# Altium schematic sheet RELAY.SchDoc
size A
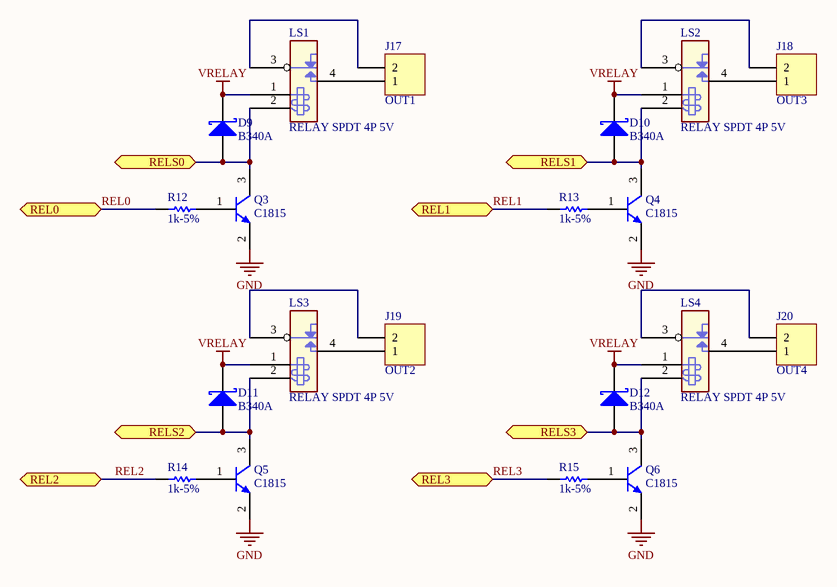
[diagram p0: RELAY.SchDoc]

## Parts
D9  B340A  [DO_213AA]
D10  B340A  [DO_213AA]
D11  B340A  [DO_213AA]
D12  B340A  [DO_213AA]
J17  OUT1  [DOMINO NORMAL 2]
J18  OUT3  [DOMINO NORMAL 2]
J19  OUT2  [DOMINO NORMAL 2]
J20  OUT4  [DOMINO NORMAL 2]
LS1  RELAY SPDT 4P 5V  [RELAY_4PIN_5A_12]
LS2  RELAY SPDT 4P 5V  [RELAY_4PIN_5A_12]
LS3  RELAY SPDT 4P 5V  [RELAY_4PIN_5A_12]
LS4  RELAY SPDT 4P 5V  [RELAY_4PIN_5A_12]
Q3  C1815  [SOT-23B_N]
Q4  C1815  [SOT-23B_N]
Q5  C1815  [SOT-23B_N]
Q6  C1815  [SOT-23B_N]
R12  1k-5%  [R0603]
R13  1k-5%  [R0603]
R14  1k-5%  [R0603]
R15  1k-5%  [R0603]

## Ports
REL0, REL1, REL2, REL3, RELS0, RELS1, RELS2, RELS3

## Nets
GND: Q3.2(E) Q4.2(E) Q5.2(E) Q6.2(E)
VRELAY: D9.2(K) D10.2(K) D11.2(K) D12.2(K) LS1.1(COIL1) LS2.1(COIL1) LS3.1(COIL1) LS4.1(COIL1)
REL0: R12.1 ; port REL0
REL1: R13.1 ; port REL1
REL2: R14.1 ; port REL2
REL3: R15.1 ; port REL3
RELS0: D9.1(A) LS1.2(COIL2) Q3.3(C) ; port RELS0
RELS1: D10.1(A) LS2.2(COIL2) Q4.3(C) ; port RELS1
RELS2: D11.1(A) LS3.2(COIL2) Q5.3(C) ; port RELS2
RELS3: D12.1(A) LS4.2(COIL2) Q6.3(C) ; port RELS3
NetJ17_1: J17.1 LS1.4(NO)
NetJ17_2: J17.2 LS1.3(COMMON)
NetJ18_1: J18.1 LS2.4(NO)
NetJ18_2: J18.2 LS2.3(COMMON)
NetJ19_1: J19.1 LS3.4(NO)
NetJ19_2: J19.2 LS3.3(COMMON)
NetJ20_1: J20.1 LS4.4(NO)
NetJ20_2: J20.2 LS4.3(COMMON)
NetQ3_1: Q3.1(B) R12.2
NetQ4_1: Q4.1(B) R13.2
NetQ5_1: Q5.1(B) R14.2
NetQ6_1: Q6.1(B) R15.2

## Library data of the parts
D9-D12 = D Schottky: DIODE SCHOTTKY 40V 3A SMA; Manufacturer Part Number: B340A-E3/61T; Manufacturer: Vishay General Semiconductor; Published: 8-Jun-2000; LatestRevisionDate: 17-Jul-2002; LatestRevisionNote: Re-released for DXP Platform.; PackageReference: DO-214-AA; Publisher: Altium Limited; Code_JEDEC: DO-214-AA; Unit Price: 0.15840; Digi-Key Part Number: B340A-E3/61TGITR-ND
J17-J20 = Header 2: Header, 2-Pin; LatestRevisionDate: 17-Jul-2002; LatestRevisionNote: Re-released for DXP Platform.; Publisher: Altium Limited
Q3-Q6 = NPN BEC: TRANSISTOR NPN 50V 150MA; Unit Price: 0.02500; Digi-Key Part Number: NA
R12-R15 = R_SMD5: Resistor SMD 5%; Manufacturer: Panasonic Electronic Components; Manufacturer Part Number: ERJ-2RKF3241X; Published: 8-Jun-2000; LatestRevisionDate: 17-Jul-2002; LatestRevisionNote: Re-released for DXP Platform.; PackageReference: R0603; Publisher: Altium Limited; Digi-Key Part Number: P3.24KLTR-ND; Unit Price: 0.00203; Value: 1k-5%